# EAGLE schematic final-project (EAGLE 9.6.2)
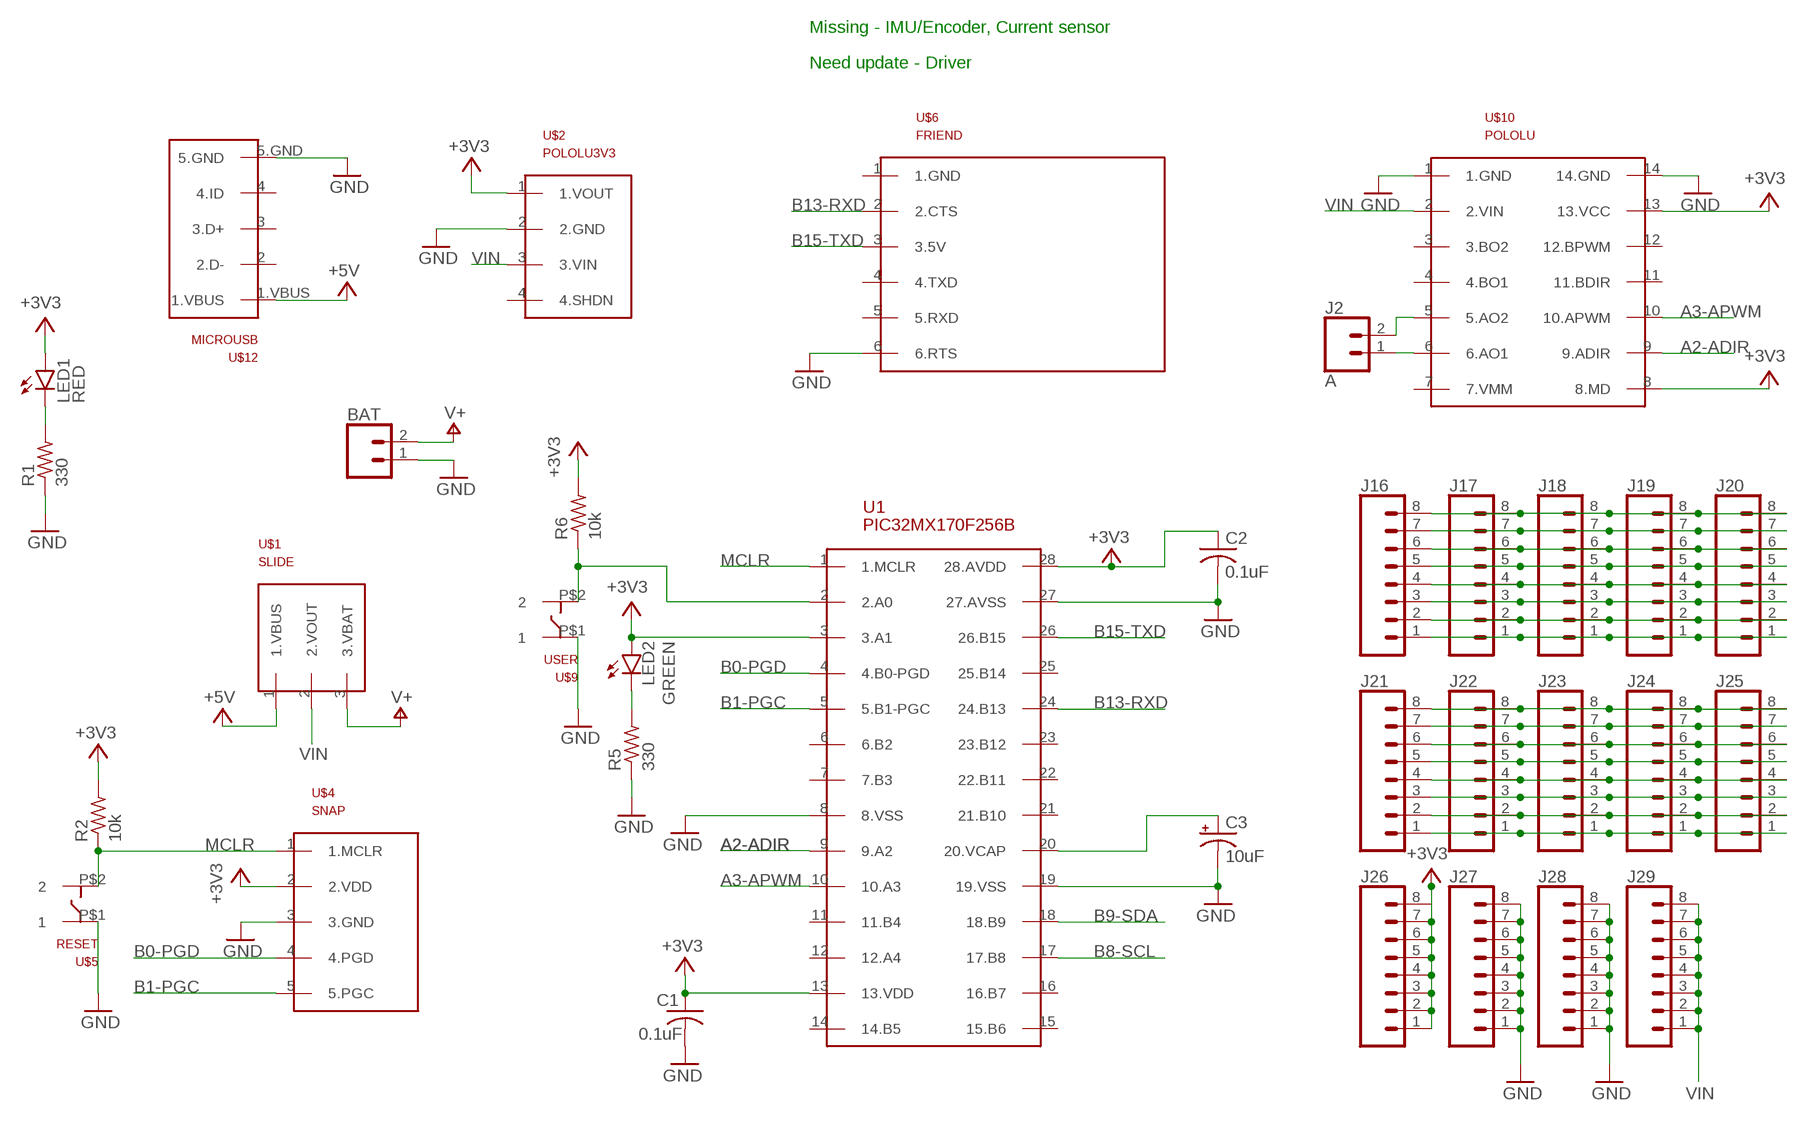
[diagram p0: schematic, sheet 1]

## Parts
BAT  CONN_02  [1X02]
C1  0.1uF  C-US025-030X050  [C025-030X050]
C2  0.1uF  C-US025-030X050  [C025-030X050]
C3  10uF  CPOL-USB45181B  [B45181B]
J2  A  CONN_02  [1X02]
J16  CONN_08"  [1X08]
J17  CONN_08"  [1X08]
J18  CONN_08"  [1X08]
J19  CONN_08"  [1X08]
J20  CONN_08"  [1X08]
J21  CONN_08"  [1X08]
J22  CONN_08"  [1X08]
J23  CONN_08"  [1X08]
J24  CONN_08"  [1X08]
J25  CONN_08"  [1X08]
J26  CONN_08"  [1X08]
J27  CONN_08"  [1X08]
J28  CONN_08"  [1X08]
J29  CONN_08"  [1X08]
LED1  RED  LED3MM  [LED3MM]
LED2  GREEN  LED3MM  [LED3MM]
R1  330  R-US_0207/10  [0207/10]
R2  10k  R-US_0207/10  [0207/10]
R5  330  R-US_0207/10  [0207/10]
R6  10k  R-US_0207/10  [0207/10]
U1  PIC32MX170F256B  [DIL28-3]
U$1  SLIDE  [SLIDE]
U$2  POLOLU3V3  [POLOLU3V3]
U$4  SNAP  [SNAP]
U$5  RESET  PUSH  [PUSH]
U$6  FRIEND  [FRIEND]
U$9  USER  PUSH  [PUSH]
U$10  POLOLU  [POLOLU]
U$12  MICROUSB  [MICROUSB]

## Nets
+3V3: C1.1 C2.1 J26.1 J26.2 J26.3 J26.4 J26.5 J26.6 J26.7 J26.8 LED1.A LED2.A R2.2 R6.2 U1.3(3.A1) U1.13(13.VDD) U1.28(28.AVDD) U$2.1(1.VOUT) U$4.2(2.VDD) U$10.8(8.MD) U$10.13(13.VCC)
+5V: U$1.1(1.VBUS) U$12.1.VBUS
A2-ADIR: U1.9(9.A2) U$10.9(9.ADIR)
A3-APWM: U1.10(10.A3) U$10.10(10.APWM)
B0-PGD: U1.4(4.B0-PGD) U$4.4(4.PGD)
B1-PGC: U1.5(5.B1-PGC) U$4.5(5.PGC)
B8-SCL: U1.17(17.B8)
B9-SDA: U1.18(18.B9)
B13-RXD: U1.24(24.B13) U$6.2(2.CTS)
B15-TXD: U1.26(26.B15) U$6.3(3.5V)
GND: BAT.1 C1.2 C2.2 C3.- J27.1 J27.2 J27.3 J27.4 J27.5 J27.6 J27.7 J27.8 J28.1 J28.2 J28.3 J28.4 J28.5 J28.6 J28.7 J28.8 R1.1 R5.1 U1.8(8.VSS) U1.19(19.VSS) U1.27(27.AVSS) U$2.2(2.GND) U$4.3(3.GND) U$5.P$1 U$6.6(6.RTS) U$9.P$1 U$10.1(1.GND) U$10.14(14.GND) U$12.5.GND
MCLR: R2.1 U1.1(1.MCLR) U$4.1(1.MCLR) U$5.P$2
MCLR1: R6.1 U1.2(2.A0) U$9.P$2
N$1: LED1.K(C) R1.2
N$2: C3.+ U1.20(20.VCAP)
N$5: LED2.K(C) R5.2
N$6: J2.1 U$10.6(6.AO1)
N$7: J2.2 U$10.5(5.AO2)
N$21: J16.8 J17.8 J18.8 J19.8 J20.8
N$22: J16.7 J17.7 J18.7 J19.7 J20.7
N$23: J16.6 J17.6 J18.6 J19.6 J20.6
N$24: J16.5 J17.5 J18.5 J19.5 J20.5
N$25: J16.4 J17.4 J18.4 J19.4 J20.4
N$26: J16.3 J17.3 J18.3 J19.3 J20.3
N$27: J16.2 J17.2 J18.2 J19.2 J20.2
N$28: J16.1 J17.1 J18.1 J19.1 J20.1
N$29: J21.8 J22.8 J23.8 J24.8 J25.8
N$30: J21.7 J22.7 J23.7 J24.7 J25.7
N$31: J21.6 J22.6 J23.6 J24.6 J25.6
N$32: J21.5 J22.5 J23.5 J24.5 J25.5
N$33: J21.4 J22.4 J23.4 J24.4 J25.4
N$34: J21.3 J22.3 J23.3 J24.3 J25.3
N$35: J21.2 J22.2 J23.2 J24.2 J25.2
N$36: J21.1 J22.1 J23.1 J24.1 J25.1
V+: BAT.2 U$1.3(3.VBAT)
VIN: J29.1 J29.2 J29.3 J29.4 J29.5 J29.6 J29.7 J29.8 U$1.2(2.VOUT) U$2.3(3.VIN) U$10.2(2.VIN)
Unconnected: U1.6(6.B2) U1.7(7.B3) U1.11(11.B4) U1.12(12.A4) U1.14(14.B5) U1.15(15.B6) U1.16(16.B7) U1.21(21.B10) U1.22(22.B11) U1.23(23.B12) U1.25(25.B14) U$2.4(4.SHDN) U$6.1(1.GND) U$6.4(4.TXD) U$6.5(5.RXD) U$10.3(3.BO2) U$10.4(4.BO1) U$10.7(7.VMM) U$10.11(11.BDIR) U$10.12(12.BPWM) U$12.2(2.D-) U$12.3(3.D+) U$12.4(4.ID)

## Notes on the sheet
- Missing - IMU/Encoder, Current sensor
- Need update - Driver

## Library data of the parts
BAT J2 = ME433-2021:CONN_02: Multi connection point. Often used as Generic Header-pin footprint for 0.1 inch spaced/style header connections On any of the 0.1 inch spaced packages, you can populate with these: Break Away Headers - Straight <https://www.sparkfun.com/products/116> (PRT-00116) Break Away Male Headers - Right Angle <https://www.sparkfun.com/products/553> (PRT-00553) Female Headers <https://www.sparkfun.com/products/115> (PRT-00115) Break Away Headers - Machine Pin <https://www.sparkfun.com/products/117> (PRT-00117) Break Away Female Headers - Swiss Machine Pin <https://www.sparkfun.com/products/743> (PRT-00743) For SCREWTERMINALS and SPRING TERMINALS visit here: Screw Terimnals on SparkFun.com <https://www.sparkfun.com/search/results?term=Screw+Terminals> (5mm/3.5mm/2.54mm spacing) This device is also useful as a general connection point to wire up your design to another part of your project. Our various solder wires solder well into these plated through hole pads. Hook-Up Wire - Assortment (Stranded, 22 AWG) <https://www.sparkfun.com/products/11375> (PRT-11375) Hook-Up Wire - Assortment (Solid Core, 22 AWG) <https://www.sparkfun.com/products/11367> (PRT-11367) View the entire wire category on our website here <https://www.sparkfun.com/categories/141> Special notes: Molex polarized connector foot print use with: PRT-08233 with associated crimp pins and housings. 2.54_SCREWTERM for use with PRT-10571. 3.5mm Screw Terminal footprints for PRT-08084 5mm Screw Terminal footprints for use with PRT-08432
C1 C2 = ME433-2021:C-US: CAPACITOR, American symbol; SPICEPREFIX: C
C3 = ME433-2021:CPOL-US: POLARIZED CAPACITOR, American symbol; SPICEPREFIX: C
J16-J29 = ME433-2021:CONN_08: Multi connection point. Often used as Generic Header-pin footprint for 0.1 inch spaced/style header connections On any of the 0.1 inch spaced packages, you can populate with these: Break Away Headers - Straight <https://www.sparkfun.com/products/116> (PRT-00116) Break Away Male Headers - Right Angle <https://www.sparkfun.com/products/553> (PRT-00553) Female Headers <https://www.sparkfun.com/products/115> (PRT-00115) Break Away Headers - Machine Pin <https://www.sparkfun.com/products/117> (PRT-00117) Break Away Female Headers - Swiss Machine Pin <https://www.sparkfun.com/products/743> (PRT-00743) Arduino Stackable Header - 8 Pin <https://www.sparkfun.com/products/9279> (PRT-09279) For SCREWTERMINALS and SPRING TERMINALS visit here: Screw Terimnals on SparkFun.com <https://www.sparkfun.com/search/results?term=Screw+Terminals> (5mm/3.5mm/2.54mm spacing) This device is also useful as a general connection point to wire up your design to another part of your project. Our various solder wires solder well into these plated through hole pads. Hook-Up Wire - Assortment (Stranded, 22 AWG) <https://www.sparkfun.com/products/11375> (PRT-11375) Hook-Up Wire - Assortment (Solid Core, 22 AWG) <https://www.sparkfun.com/products/11367> (PRT-11367) View the entire wire category on our website here <https://www.sparkfun.com/categories/141> Special notes: Molex polarized connector foot print use with SKU : PRT-08231 with associated crimp pins and housings. 1MM SMD Version SKU: PRT-10208 NOTES ON THE VARIANTS LOCK and LOCK_LONGPADS... This footprint was designed to help hold the alignment of a through-hole component (i.e. 6-pin header) while soldering it into place. You may notice that each hole has been shifted either up or down by 0.005 of an inch from it's more standard position (which is a perfectly straight line). This slight alteration caused the pins (the squares in the middle) to touch the edges of the holes. Because they are alternating, it causes a "brace" to hold the component in place. 0.005 has proven to be the perfect amount of "off-center" position when using our standard breakaway headers. Although looks a little odd when you look at the bare footprint, once you have a header in there, the alteration is very hard to notice. Also,if you push a header all the way into place, it is covered up entirely on the bottom side.; PROD_ID: CONN-08438
LED1 LED2 = ME433-2021:LED: LED OSRAM: - CHIPLED LG R971, LG N971, LY N971, LG Q971, LY Q971, LO R971, LY R971 LH N974, LH R974 LS Q976, LO Q976, LY Q976 LO Q996 - Hyper CHIPLED LW Q18S LB Q993, LB Q99A, LB R99A - SideLED LS A670, LO A670, LY A670, LG A670, LP A670 LB A673, LV A673, LT A673, LW A673 LH A674 LY A675 LS A676, LA A676, LO A676, LY A676, LW A676 LS A679, LY A679, LG A679 - Hyper Micro SIDELED® LS Y876, LA Y876, LO Y876, LY Y876 LT Y87S - SmartLED LW L88C, LW L88S LB L89C, LB L89S, LG L890 LS L89K, LO L89K, LY L89K LS L896, LA L896, LO L896, LY L896 - TOPLED LS T670, LO T670, LY T670, LG T670, LP T670 LSG T670, LSP T670, LSY T670, LOP T670, LYG T670 LG T671, LOG T671, LSG T671 LB T673, LV T673, LT T673, LW T673 LH T674 LS T676, LA T676, LO T676, LY T676, LB T676, LH T676, LSB T676, LW T676 LB T67C, LV T67C, LT T67C, LS T67K, LO T67K, LY T67K, LW E67C LS E67B, LA E67B, LO E67B, LY E67B, LB E67C, LV E67C, LT E67C LW T67C LS T679, LY T679, LG T679 LS T770, LO T770, LY T770, LG T770, LP T770 LB T773, LV T773, LT T773, LW T773 LH T774 LS E675, LA E675, LY E675, LS T675 LS T776, LA T776, LO T776, LY T776, LB T776 LHGB T686 LT T68C, LB T68C - Hyper Mini TOPLED® LB M676 - Mini TOPLED Santana® LG M470 LS M47K, LO M47K, LY M47K Source: http://www.osram.convergy.de LUXEON: - LUMILED® LXK2-PW12-R00, LXK2-PW12-S00, LXK2-PW14-U00, LXK2-PW14-V00 LXK2-PM12-R00, LXK2-PM12-S00, LXK2-PM14-U00 LXK2-PE12-Q00, LXK2-PE12-R00, LXK2-PE12-S00, LXK2-PE14-T00, LXK2-PE14-U00 LXK2-PB12-K00, LXK2-PB12-L00, LXK2-PB12-M00, LXK2-PB14-N00, LXK2-PB14-P00, LXK2-PB14-Q00 LXK2-PR12-L00, LXK2-PR12-M00, LXK2-PR14-Q00, LXK2-PR14-R00 LXK2-PD12-Q00, LXK2-PD12-R00, LXK2-PD12-S00 LXK2-PH12-R00, LXK2-PH12-S00 LXK2-PL12-P00, LXK2-PL12-Q00, LXK2-PL12-R00 Source: www.luxeon.com KINGBRIGHT: KA-3528ASYC Source: www.kingbright.com
R1 R2 R5 R6 = ME433-2021:R-US_: RESISTOR, American symbol; SPICEPREFIX: R
U1 = ME433-2021:PIC32MX170F256B
U$1 = ME433-2021:SLIDE
U$2 = ME433-2021:POLOLU3V3
U$4 = ME433-2021:SNAP
U$5 U$9 = ME433-2021:PUSH
U$6 = ME433-2021:FRIEND
U$10 = ME433-2021:POLOLU
U$12 = ME433-2021:MICROUSB